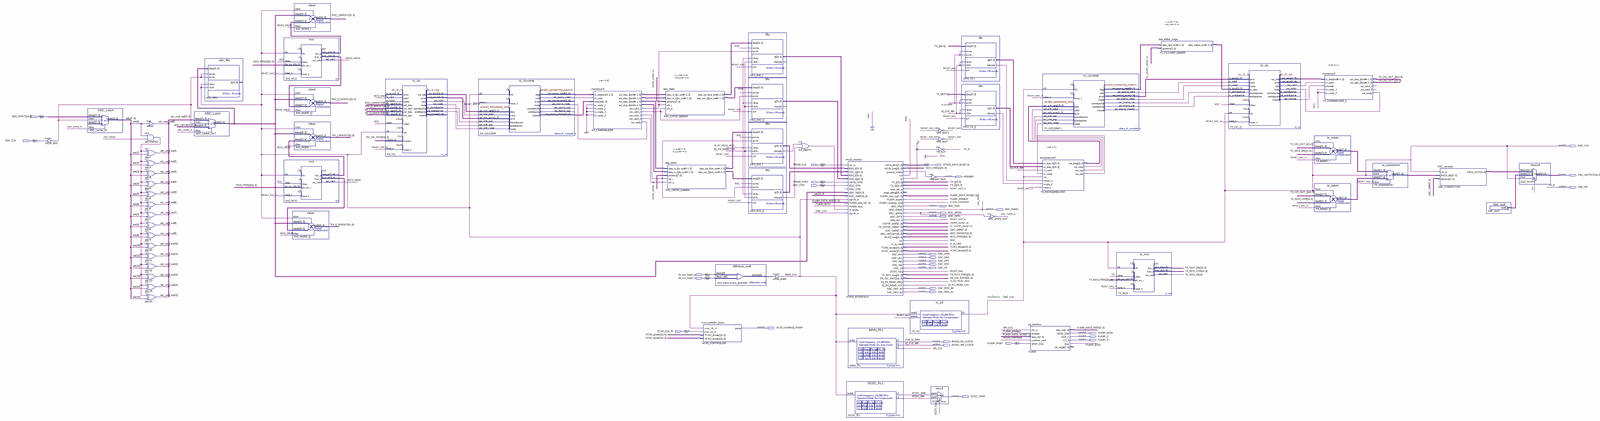
[diagram p0: schematic sheet, whole]
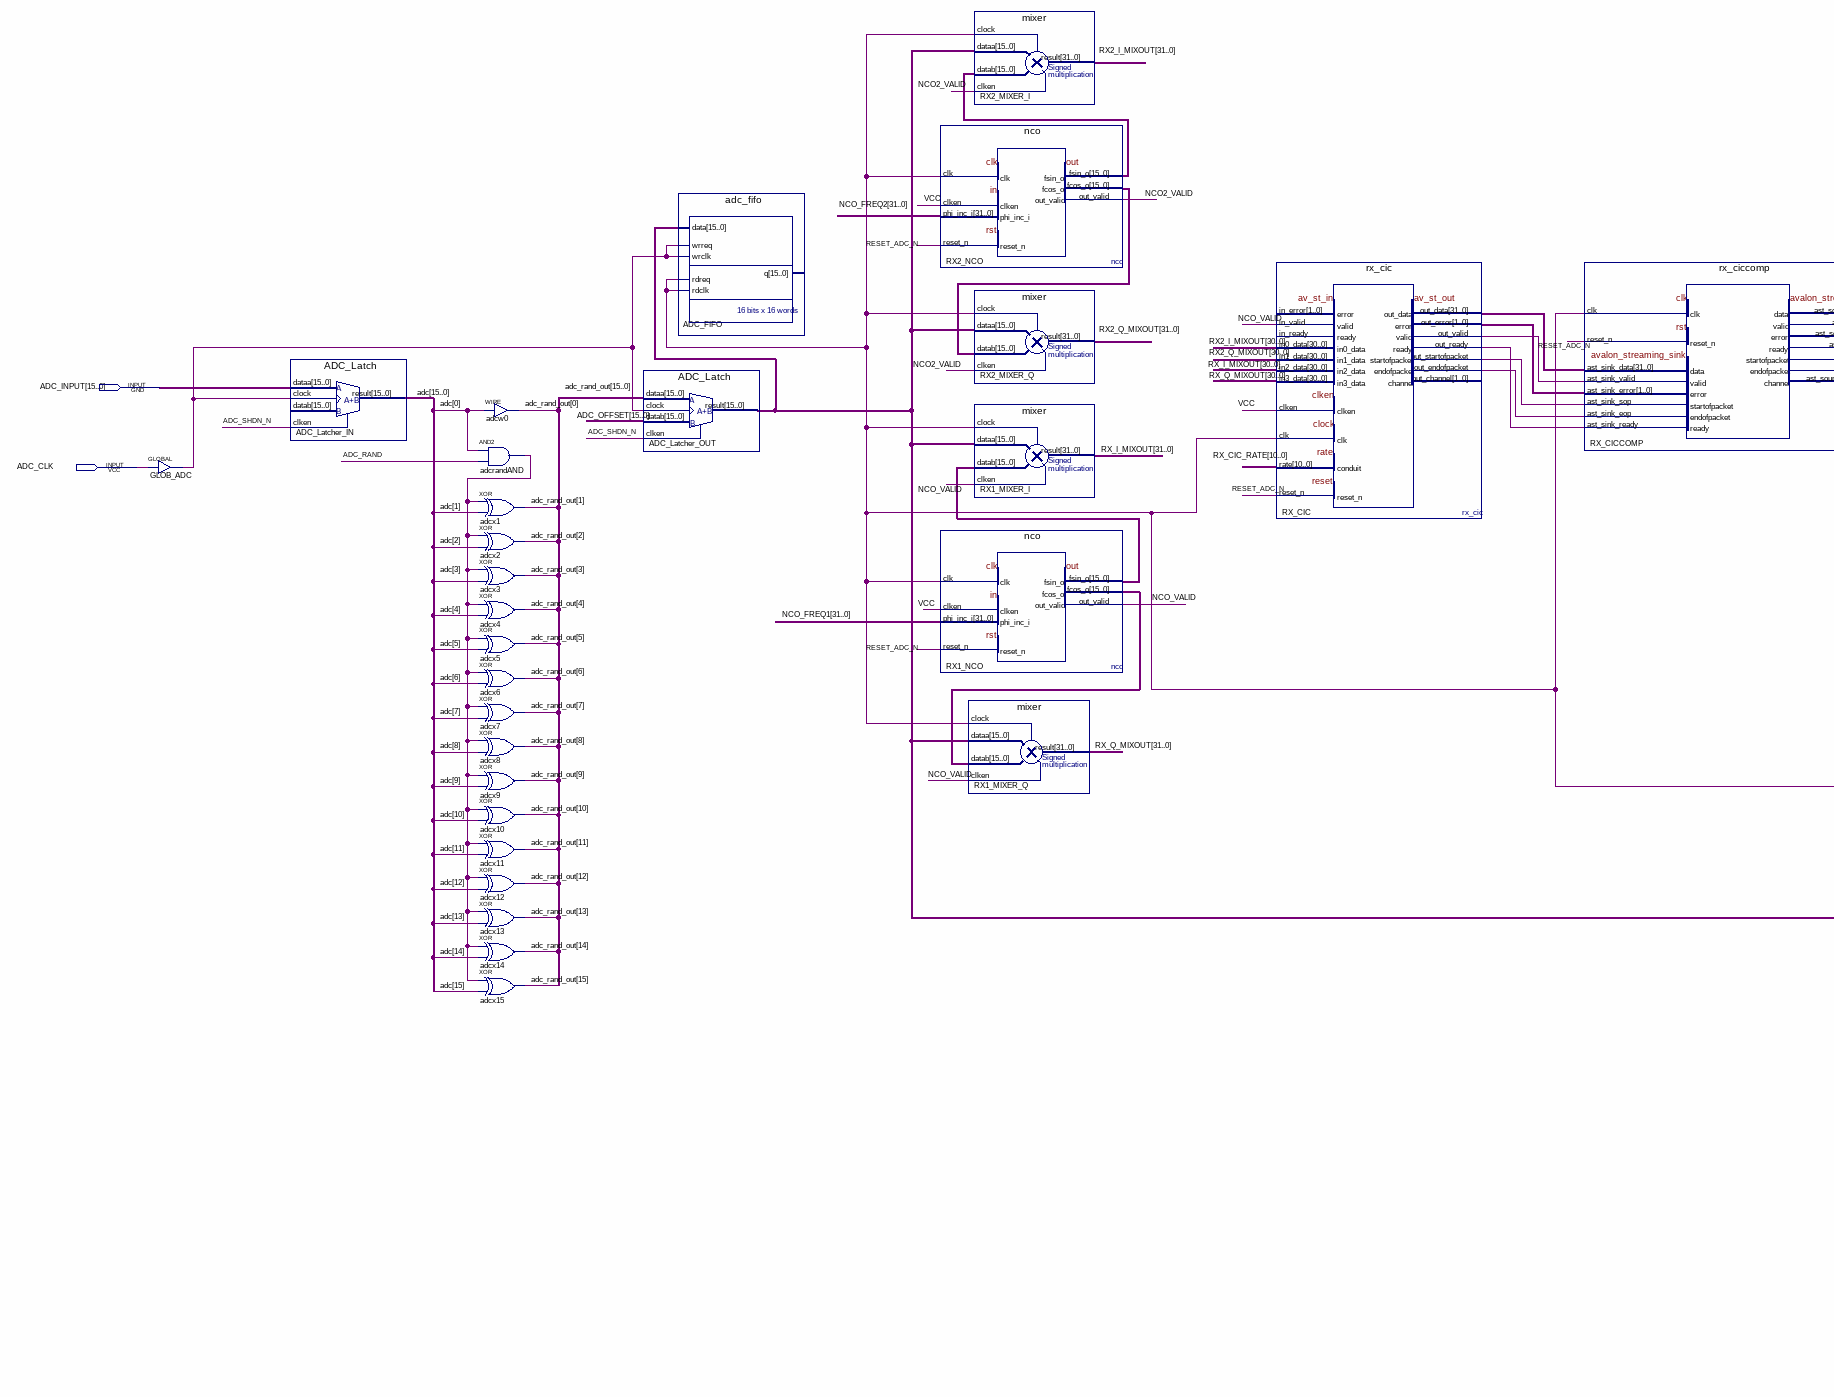
[diagram p1: schematic sheet, left part]
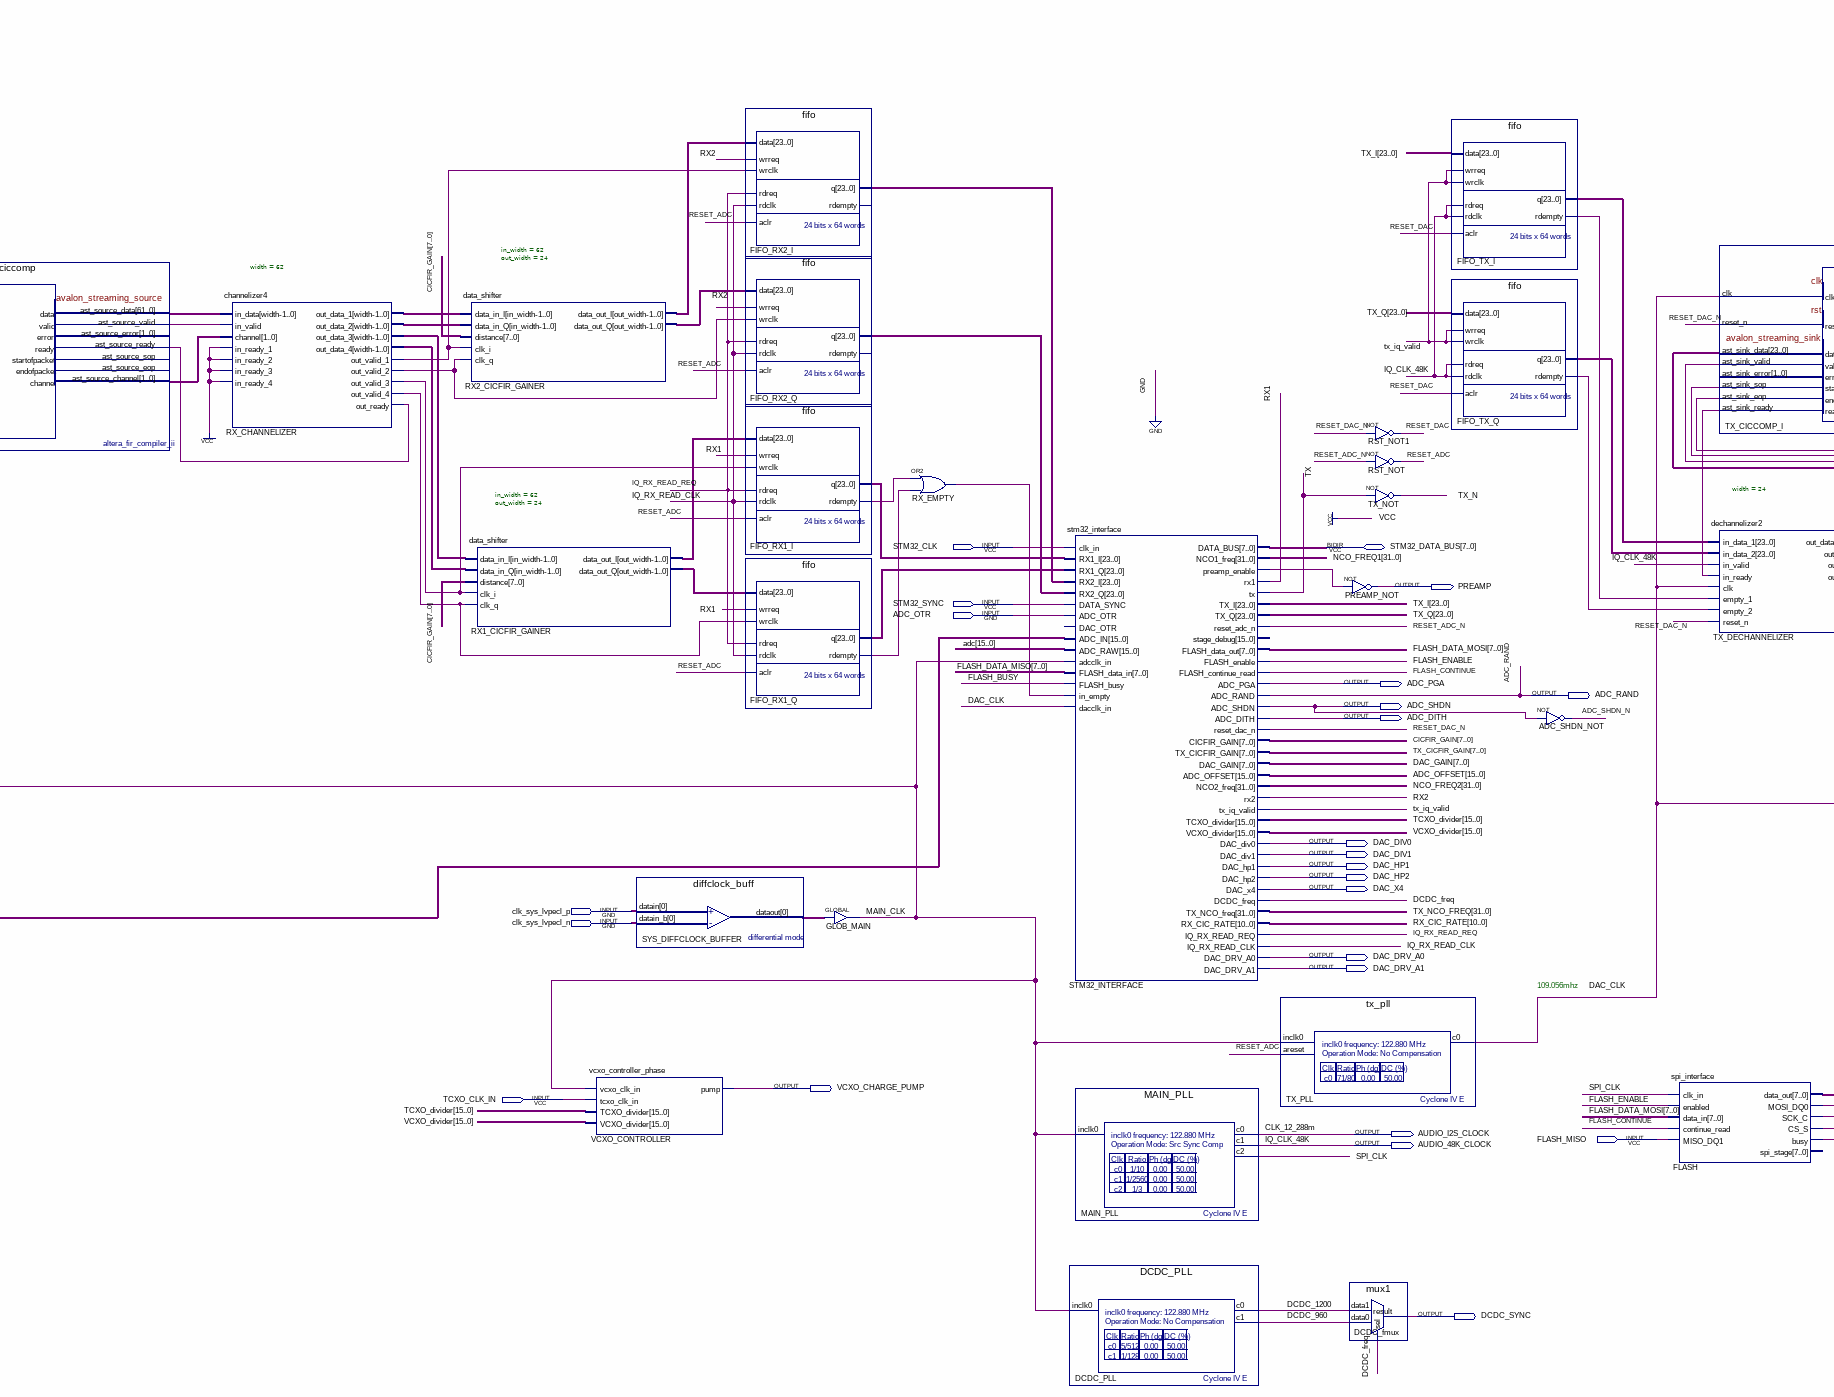
[diagram p2: schematic sheet, centre part]
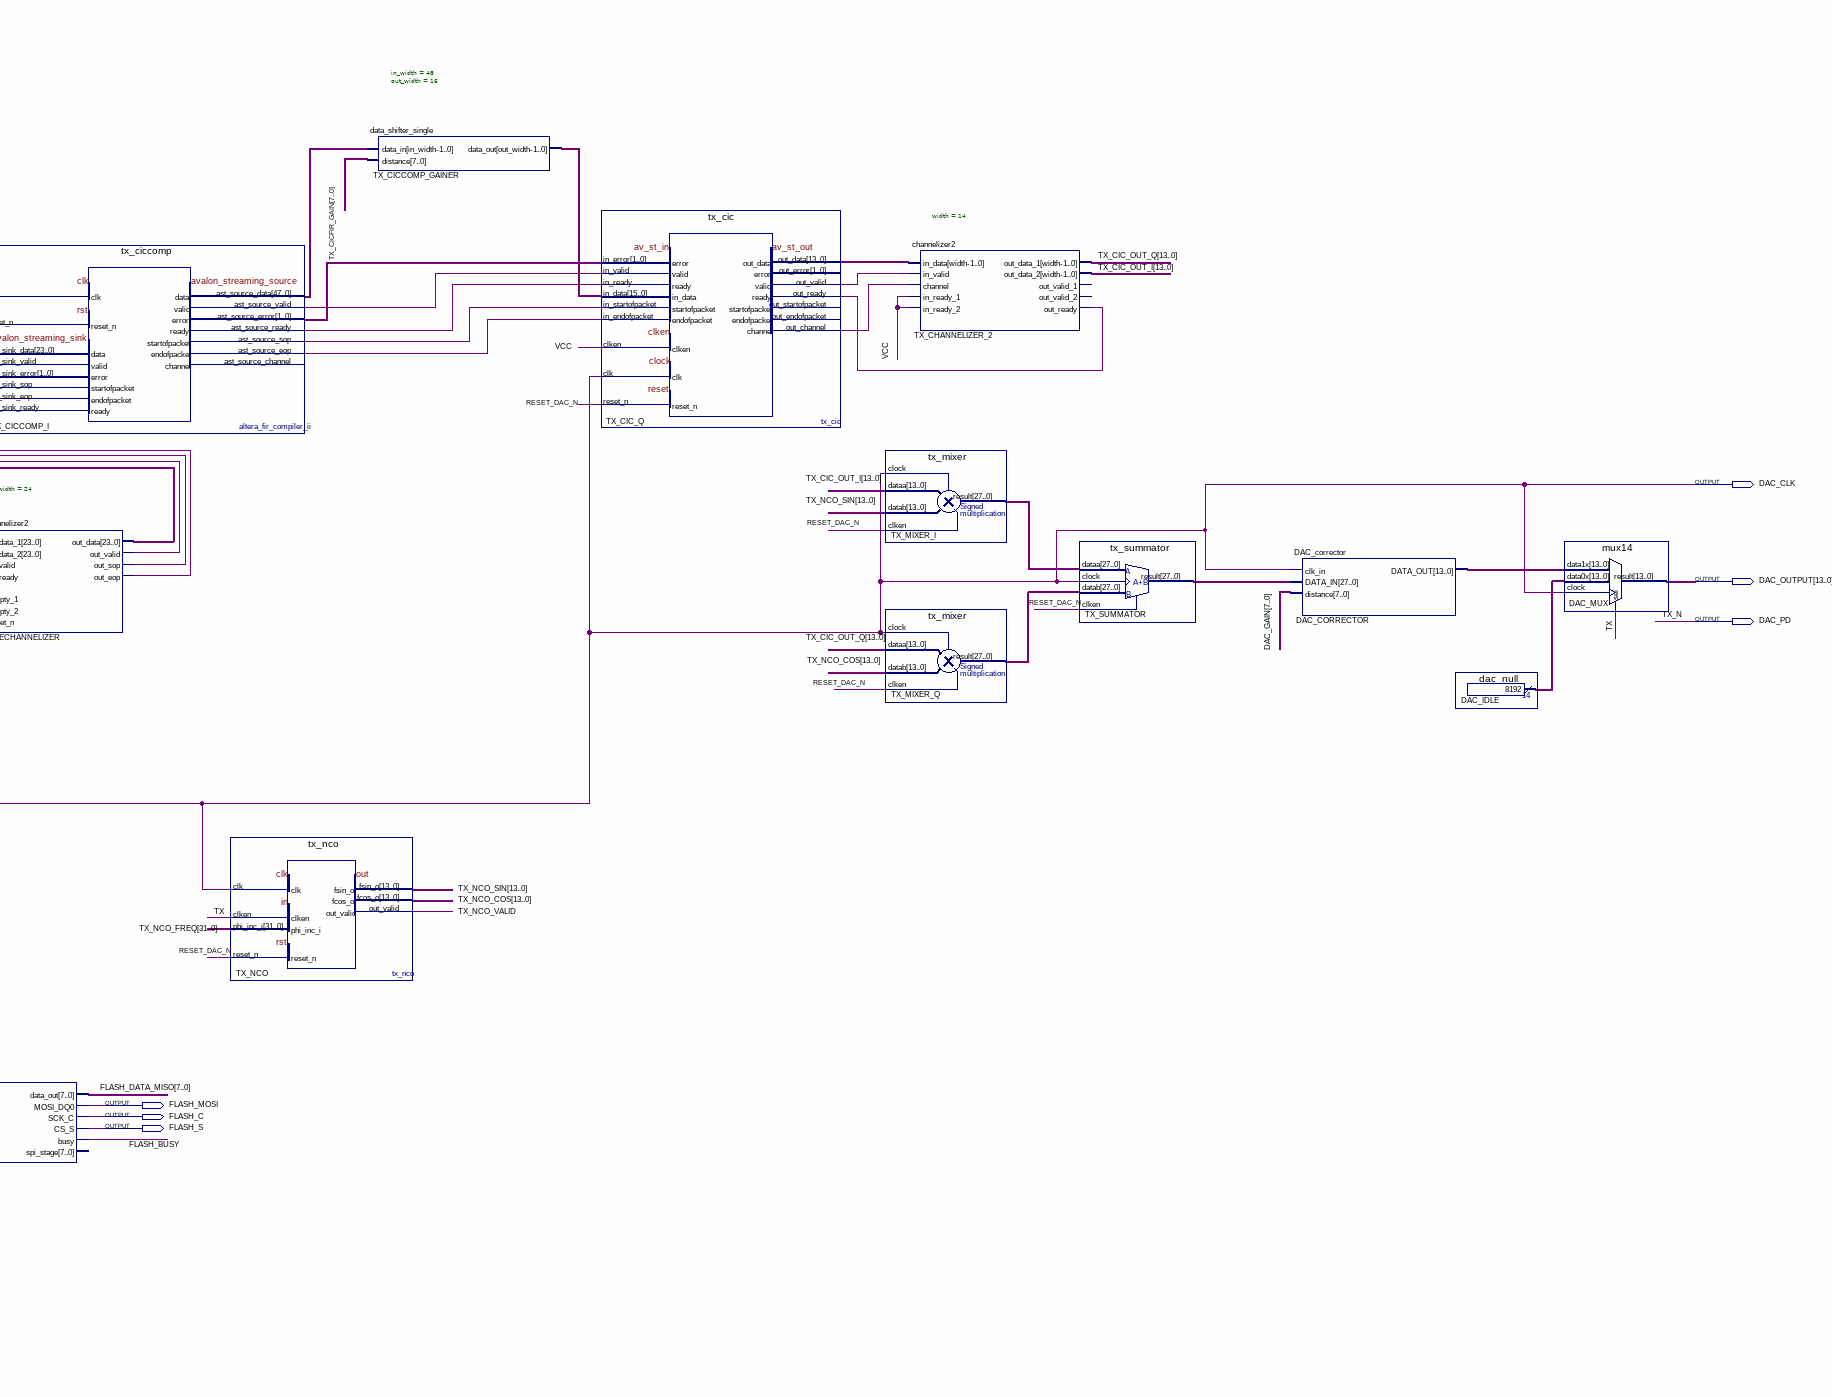
[diagram p3: schematic sheet, right part]
// Quartus schematic WOLF.bdf as structural Verilog: 65 symbols, 32 pins
module WOLF (
  input  [15:0] ADC_INPUT,
  input  ADC_CLK,
  input  STM32_CLK,
  input  STM32_SYNC,
  input  ADC_OTR,
  input  clk_sys_lvpecl_p,
  input  clk_sys_lvpecl_n,
  input  TCXO_CLK_IN,
  input  FLASH_MISO,
  inout  [7:0] STM32_DATA_BUS,
  output DAC_CLK,
  output [13:0] DAC_OUTPUT,
  output PREAMP,
  output DAC_PD,
  output ADC_PGA,
  output ADC_RAND,
  output ADC_SHDN,
  output ADC_DITH,
  output DAC_DIV0,
  output DAC_DIV1,
  output DAC_HP1,
  output DAC_HP2,
  output DAC_X4,
  output DAC_DRV_A0,
  output DAC_DRV_A1,
  output VCXO_CHARGE_PUMP,
  output FLASH_MOSI,
  output FLASH_C,
  output FLASH_S,
  output AUDIO_I2S_CLOCK,
  output AUDIO_48K_CLOCK,
  output DCDC_SYNC
);

  wire ADC_SHDN_N, adcrandAND_out, DCDC_960, DCDC_1200, DCDC_freq, FIFO_RX1_I_rdempty, FIFO_RX1_Q_rdempty,
       FIFO_TX_I_rdempty, FIFO_TX_Q_rdempty, FLASH_BUSY, FLASH_CONTINUE, FLASH_ENABLE, GLOB_ADC_out,
       IQ_RX_READ_CLK, IQ_RX_READ_REQ, MAIN_CLK, NCO2_VALID, NCO_VALID, RESET_ADC, RESET_ADC_N, RESET_DAC,
       RESET_DAC_N, RX1, RX2, RX_CHANNELIZER_out_ready, RX_CHANNELIZER_out_valid_1,
       RX_CHANNELIZER_out_valid_2, RX_CHANNELIZER_out_valid_3, RX_CHANNELIZER_out_valid_4,
       RX_CIC_out_endofpacket, RX_CIC_out_startofpacket, RX_CIC_out_valid, RX_CICCOMP_ast_sink_ready,
       RX_CICCOMP_ast_source_valid, RX_EMPTY_out, SPI_CLK, STM32_INTERFACE_preamp_enable,
       SYS_DIFFCLOCK_BUFFER_dataout, TX, TX_CHANNELIZER_2_out_ready, TX_CIC_Q_in_ready, TX_CIC_Q_out_channel,
       TX_CIC_Q_out_valid, TX_CICCOMP_I_ast_sink_ready, TX_CICCOMP_I_ast_source_eop,
       TX_CICCOMP_I_ast_source_sop, TX_CICCOMP_I_ast_source_valid, TX_DECHANNELIZER_out_eop,
       TX_DECHANNELIZER_out_sop, TX_DECHANNELIZER_out_valid, tx_iq_valid, TX_NCO_VALID;
  wire [1:0] RX_CIC_out_error, RX_CICCOMP_ast_source_channel, TX_CICCOMP_I_ast_source_error;
  wire [7:0] CICFIR_GAIN, DAC_GAIN, FLASH_DATA_MISO, FLASH_DATA_MOSI, TX_CICFIR_GAIN;
  wire [10:0] RX_CIC_RATE;
  wire [13:0] DAC_CORRECTOR_data_out, DAC_IDLE_result, TX_CIC_OUT_I, TX_CIC_OUT_Q, TX_CIC_Q_out_data,
       TX_NCO_COS, TX_NCO_SIN;
  wire [15:0] adc, ADC_Latcher_OUT_result, ADC_OFFSET, adc_rand_out, RX1_NCO_fcos_o, RX1_NCO_fsin_o,
       RX2_NCO_fcos_o, RX2_NCO_fsin_o, TCXO_divider, TX_CICCOMP_GAINER_data_out, VCXO_divider;
  wire [23:0] FIFO_RX1_I_q, FIFO_RX1_Q_q, FIFO_RX2_I_q, FIFO_RX2_Q_q, FIFO_TX_I_q, FIFO_TX_Q_q,
       RX1_CICFIR_GAINER_data_out_i, RX1_CICFIR_GAINER_data_out_q, RX2_CICFIR_GAINER_data_out_i,
       RX2_CICFIR_GAINER_data_out_q, TX_DECHANNELIZER_out_data, TX_I, TX_Q;
  wire [27:0] TX_MIXER_I_result, TX_MIXER_Q_result, TX_SUMMATOR_result;
  wire [31:0] NCO_FREQ1, NCO_FREQ2, RX2_I_MIXOUT, RX2_Q_MIXOUT, RX_CIC_out_data, RX_I_MIXOUT, RX_Q_MIXOUT,
       TX_NCO_FREQ;
  wire [47:0] TX_CICCOMP_I_ast_source_data;
  wire [61:0] RX_CHANNELIZER_out_data_1, RX_CHANNELIZER_out_data_2, RX_CHANNELIZER_out_data_3,
       RX_CHANNELIZER_out_data_4, RX_CICCOMP_ast_source_data;

  GLOBAL GLOB_ADC (.IN(ADC_CLK), .OUT(GLOB_ADC_out));
  ADC_Latch ADC_Latcher_IN (.dataa(ADC_INPUT), .clken(ADC_SHDN_N), .clock(GLOB_ADC_out), .result(adc));  // open: datab
  assign adc_rand_out[0] = adc[0];  // WIRE adcw0
  and adcrandAND (adcrandAND_out, adc[0], ADC_RAND);
  xor adcx1 (adc_rand_out[1], adcrandAND_out, adc[1]);
  xor adcx2 (adc_rand_out[2], adcrandAND_out, adc[2]);
  xor adcx3 (adc_rand_out[3], adcrandAND_out, adc[3]);
  xor adcx4 (adc_rand_out[4], adcrandAND_out, adc[4]);
  xor adcx5 (adc_rand_out[5], adcrandAND_out, adc[5]);
  xor adcx6 (adc_rand_out[6], adcrandAND_out, adc[6]);
  xor adcx7 (adc_rand_out[7], adcrandAND_out, adc[7]);
  xor adcx8 (adc_rand_out[8], adcrandAND_out, adc[8]);
  xor adcx9 (adc_rand_out[9], adcrandAND_out, adc[9]);
  xor adcx10 (adc_rand_out[10], adcrandAND_out, adc[10]);
  xor adcx11 (adc_rand_out[11], adcrandAND_out, adc[11]);
  xor adcx12 (adc_rand_out[12], adcrandAND_out, adc[12]);
  xor adcx13 (adc_rand_out[13], adcrandAND_out, adc[13]);
  xor adcx14 (adc_rand_out[14], adcrandAND_out, adc[14]);
  xor adcx15 (adc_rand_out[15], adcrandAND_out, adc[15]);
  adc_fifo ADC_FIFO (
    .data(ADC_Latcher_OUT_result), .wrreq(GLOB_ADC_out), .wrclk(GLOB_ADC_out), .rdreq(MAIN_CLK),
    .rdclk(MAIN_CLK));  // open: q
  ADC_Latch ADC_Latcher_OUT (
    .dataa(adc_rand_out), .datab(ADC_OFFSET), .clken(ADC_SHDN_N), .clock(GLOB_ADC_out),
    .result(ADC_Latcher_OUT_result));
  nco RX2_NCO (
    .clk(MAIN_CLK), .clken(1'b1), .phi_inc_i(NCO_FREQ2), .reset_n(RESET_ADC_N), .fsin_o(RX2_NCO_fsin_o),
    .fcos_o(RX2_NCO_fcos_o), .out_valid(NCO2_VALID));
  nco RX1_NCO (
    .clk(MAIN_CLK), .clken(1'b1), .phi_inc_i(NCO_FREQ1), .reset_n(RESET_ADC_N), .fsin_o(RX1_NCO_fsin_o),
    .fcos_o(RX1_NCO_fcos_o), .out_valid(NCO_VALID));
  mixer RX2_MIXER_I (
    .clock(MAIN_CLK), .dataa(ADC_Latcher_OUT_result), .datab(RX2_NCO_fsin_o), .clken(NCO2_VALID),
    .result(RX2_I_MIXOUT));
  mixer RX2_MIXER_Q (
    .clock(MAIN_CLK), .dataa(ADC_Latcher_OUT_result), .datab(RX2_NCO_fcos_o), .clken(NCO2_VALID),
    .result(RX2_Q_MIXOUT));
  mixer RX1_MIXER_I (
    .clock(MAIN_CLK), .dataa(ADC_Latcher_OUT_result), .datab(RX1_NCO_fsin_o), .clken(NCO_VALID),
    .result(RX_I_MIXOUT));
  mixer RX1_MIXER_Q (
    .clock(MAIN_CLK), .dataa(ADC_Latcher_OUT_result), .datab(RX1_NCO_fcos_o), .clken(NCO_VALID),
    .result(RX_Q_MIXOUT));
  rx_cic RX_CIC (
    .in_valid(NCO_VALID), .in0_data(RX2_I_MIXOUT[30:0]), .in1_data(RX2_Q_MIXOUT[30:0]),
    .in2_data(RX_I_MIXOUT[30:0]), .in3_data(RX_Q_MIXOUT[30:0]), .out_ready(RX_CICCOMP_ast_sink_ready),
    .clken(1'b1), .clk(MAIN_CLK), .rate(RX_CIC_RATE), .reset_n(RESET_ADC_N), .out_data(RX_CIC_out_data),
    .out_error(RX_CIC_out_error), .out_valid(RX_CIC_out_valid), .out_startofpacket(RX_CIC_out_startofpacket),
    .out_endofpacket(RX_CIC_out_endofpacket));  // open: in_error, in_ready, out_channel
  rx_ciccomp RX_CICCOMP (
    .clk(MAIN_CLK), .reset_n(RESET_ADC_N), .ast_sink_data(RX_CIC_out_data),
    .ast_sink_valid(RX_CIC_out_valid), .ast_sink_error(RX_CIC_out_error),
    .ast_sink_sop(RX_CIC_out_startofpacket), .ast_sink_eop(RX_CIC_out_endofpacket),
    .ast_source_ready(RX_CHANNELIZER_out_ready), .ast_sink_ready(RX_CICCOMP_ast_sink_ready),
    .ast_source_data(RX_CICCOMP_ast_source_data), .ast_source_valid(RX_CICCOMP_ast_source_valid),
    .ast_source_channel(RX_CICCOMP_ast_source_channel));  // open: ast_source_error, ast_source_sop, ast_source_eop
  channelizer4 #(.width(62)) RX_CHANNELIZER (
    .in_data(RX_CICCOMP_ast_source_data), .in_valid(RX_CICCOMP_ast_source_valid),
    .channel(RX_CICCOMP_ast_source_channel), .in_ready_1(1'b1), .in_ready_2(1'b1), .in_ready_3(1'b1),
    .in_ready_4(1'b1), .out_data_1(RX_CHANNELIZER_out_data_1), .out_data_2(RX_CHANNELIZER_out_data_2),
    .out_data_3(RX_CHANNELIZER_out_data_3), .out_data_4(RX_CHANNELIZER_out_data_4),
    .out_valid_1(RX_CHANNELIZER_out_valid_1), .out_valid_2(RX_CHANNELIZER_out_valid_2),
    .out_valid_3(RX_CHANNELIZER_out_valid_3), .out_valid_4(RX_CHANNELIZER_out_valid_4),
    .out_ready(RX_CHANNELIZER_out_ready));
  data_shifter #(.in_width(62), .out_width(24)) RX2_CICFIR_GAINER (
    .data_in_I(RX_CHANNELIZER_out_data_1), .data_in_Q(RX_CHANNELIZER_out_data_2), .distance(CICFIR_GAIN),
    .clk_i(RX_CHANNELIZER_out_valid_1), .clk_q(RX_CHANNELIZER_out_valid_2),
    .data_out_I(RX2_CICFIR_GAINER_data_out_i), .data_out_Q(RX2_CICFIR_GAINER_data_out_q));
  data_shifter #(.in_width(62), .out_width(24)) RX1_CICFIR_GAINER (
    .data_in_I(RX_CHANNELIZER_out_data_3), .data_in_Q(RX_CHANNELIZER_out_data_4), .distance(CICFIR_GAIN),
    .clk_i(RX_CHANNELIZER_out_valid_3), .clk_q(RX_CHANNELIZER_out_valid_4),
    .data_out_I(RX1_CICFIR_GAINER_data_out_i), .data_out_Q(RX1_CICFIR_GAINER_data_out_q));
  vcxo_controller_phase VCXO_CONTROLLER (
    .vcxo_clk_in(MAIN_CLK), .tcxo_clk_in(TCXO_CLK_IN), .TCXO_divider(TCXO_divider),
    .VCXO_divider(VCXO_divider), .pump(VCXO_CHARGE_PUMP));
  diffclock_buff SYS_DIFFCLOCK_BUFFER (
    .datain(clk_sys_lvpecl_p), .datain_b(clk_sys_lvpecl_n), .dataout(SYS_DIFFCLOCK_BUFFER_dataout));
  fifo FIFO_RX2_I (
    .data(RX2_CICFIR_GAINER_data_out_i), .wrreq(RX2), .wrclk(RX_CHANNELIZER_out_valid_1),
    .rdreq(IQ_RX_READ_REQ), .rdclk(IQ_RX_READ_CLK), .aclr(RESET_ADC), .q(FIFO_RX2_I_q));  // open: rdempty
  fifo FIFO_RX2_Q (
    .data(RX2_CICFIR_GAINER_data_out_q), .wrreq(RX2), .wrclk(RX_CHANNELIZER_out_valid_2),
    .rdreq(IQ_RX_READ_REQ), .rdclk(IQ_RX_READ_CLK), .aclr(RESET_ADC), .q(FIFO_RX2_Q_q));  // open: rdempty
  fifo FIFO_RX1_I (
    .data(RX1_CICFIR_GAINER_data_out_i), .wrreq(RX1), .wrclk(RX_CHANNELIZER_out_valid_3),
    .rdreq(IQ_RX_READ_REQ), .rdclk(IQ_RX_READ_CLK), .aclr(RESET_ADC), .q(FIFO_RX1_I_q),
    .rdempty(FIFO_RX1_I_rdempty));
  fifo FIFO_RX1_Q (
    .data(RX1_CICFIR_GAINER_data_out_q), .wrreq(RX1), .wrclk(RX_CHANNELIZER_out_valid_4),
    .rdreq(IQ_RX_READ_REQ), .rdclk(IQ_RX_READ_CLK), .aclr(RESET_ADC), .q(FIFO_RX1_Q_q),
    .rdempty(FIFO_RX1_Q_rdempty));
  GLOBAL GLOB_MAIN (.IN(SYS_DIFFCLOCK_BUFFER_dataout), .OUT(MAIN_CLK));
  or RX_EMPTY (RX_EMPTY_out, FIFO_RX1_I_rdempty, FIFO_RX1_Q_rdempty);
  stm32_interface STM32_INTERFACE (
    .clk_in(STM32_CLK), .RX1_I(FIFO_RX1_I_q), .RX1_Q(FIFO_RX1_Q_q), .RX2_I(FIFO_RX2_I_q),
    .RX2_Q(FIFO_RX2_Q_q), .DATA_SYNC(STM32_SYNC), .ADC_OTR(ADC_OTR), .ADC_IN(ADC_Latcher_OUT_result),
    .ADC_RAW(adc), .adcclk_in(MAIN_CLK), .FLASH_data_in(FLASH_DATA_MISO), .FLASH_busy(FLASH_BUSY),
    .in_empty(RX_EMPTY_out), .dacclk_in(DAC_CLK), .NCO1_freq(NCO_FREQ1),
    .preamp_enable(STM32_INTERFACE_preamp_enable), .rx1(RX1), .tx(TX), .TX_I(TX_I), .TX_Q(TX_Q),
    .reset_adc_n(RESET_ADC_N), .FLASH_data_out(FLASH_DATA_MOSI), .FLASH_enable(FLASH_ENABLE),
    .FLASH_continue_read(FLASH_CONTINUE), .ADC_PGA(ADC_PGA), .ADC_RAND(ADC_RAND), .ADC_SHDN(ADC_SHDN),
    .ADC_DITH(ADC_DITH), .reset_dac_n(RESET_DAC_N), .CICFIR_GAIN(CICFIR_GAIN),
    .TX_CICFIR_GAIN(TX_CICFIR_GAIN), .DAC_GAIN(DAC_GAIN), .ADC_OFFSET(ADC_OFFSET), .NCO2_freq(NCO_FREQ2),
    .rx2(RX2), .tx_iq_valid(tx_iq_valid), .TCXO_divider(TCXO_divider), .VCXO_divider(VCXO_divider),
    .DAC_div0(DAC_DIV0), .DAC_div1(DAC_DIV1), .DAC_hp1(DAC_HP1), .DAC_hp2(DAC_HP2), .DAC_x4(DAC_X4),
    .DCDC_freq(DCDC_freq), .TX_NCO_freq(TX_NCO_FREQ), .RX_CIC_RATE(RX_CIC_RATE),
    .IQ_RX_READ_REQ(IQ_RX_READ_REQ), .IQ_RX_READ_CLK(IQ_RX_READ_CLK), .DAC_DRV_A0(DAC_DRV_A0),
    .DAC_DRV_A1(DAC_DRV_A1), .DATA_BUS(STM32_DATA_BUS));  // open: DAC_OTR, stage_debug
  MAIN_PLL MAIN_PLL (.inclk0(MAIN_CLK), .c0(AUDIO_I2S_CLOCK), .c1(AUDIO_48K_CLOCK), .c2(SPI_CLK));
  DCDC_PLL DCDC_PLL (.inclk0(MAIN_CLK), .c0(DCDC_1200), .c1(DCDC_960));
  tx_pll TX_PLL (.inclk0(MAIN_CLK), .areset(RESET_ADC), .c0(DAC_CLK));
  not RST_NOT1 (RESET_DAC, RESET_DAC_N);
  not RST_NOT (RESET_ADC, RESET_ADC_N);
  not TX_NOT (DAC_PD, TX);
  not PREAMP_NOT (PREAMP, STM32_INTERFACE_preamp_enable);
  mux1 DCDC_fmux (.data1(DCDC_1200), .data0(DCDC_960), .sel(DCDC_freq), .result(DCDC_SYNC));
  fifo FIFO_TX_I (
    .data(TX_I), .wrreq(tx_iq_valid), .wrclk(tx_iq_valid), .rdreq(AUDIO_48K_CLOCK), .rdclk(AUDIO_48K_CLOCK),
    .aclr(RESET_DAC), .q(FIFO_TX_I_q), .rdempty(FIFO_TX_I_rdempty));
  fifo FIFO_TX_Q (
    .data(TX_Q), .wrreq(tx_iq_valid), .wrclk(tx_iq_valid), .rdreq(AUDIO_48K_CLOCK), .rdclk(AUDIO_48K_CLOCK),
    .aclr(RESET_DAC), .q(FIFO_TX_Q_q), .rdempty(FIFO_TX_Q_rdempty));
  not ADC_SHDN_NOT (ADC_SHDN_N, ADC_SHDN);
  spi_interface FLASH (
    .clk_in(SPI_CLK), .enabled(FLASH_ENABLE), .data_in(FLASH_DATA_MOSI), .continue_read(FLASH_CONTINUE),
    .MISO_DQ1(FLASH_MISO), .data_out(FLASH_DATA_MISO), .MOSI_DQ0(FLASH_MOSI), .SCK_C(FLASH_C),
    .CS_S(FLASH_S), .busy(FLASH_BUSY));  // open: spi_stage
  tx_ciccomp TX_CICCOMP_I (
    .clk(DAC_CLK), .reset_n(RESET_DAC_N), .ast_sink_data(TX_DECHANNELIZER_out_data),
    .ast_sink_valid(TX_DECHANNELIZER_out_valid), .ast_sink_sop(TX_DECHANNELIZER_out_sop),
    .ast_sink_eop(TX_DECHANNELIZER_out_eop), .ast_source_ready(TX_CIC_Q_in_ready),
    .ast_sink_ready(TX_CICCOMP_I_ast_sink_ready), .ast_source_data(TX_CICCOMP_I_ast_source_data),
    .ast_source_valid(TX_CICCOMP_I_ast_source_valid), .ast_source_error(TX_CICCOMP_I_ast_source_error),
    .ast_source_sop(TX_CICCOMP_I_ast_source_sop), .ast_source_eop(TX_CICCOMP_I_ast_source_eop));  // open: ast_sink_error, ast_source_channel
  dechannelizer2 #(.width(24)) TX_DECHANNELIZER (
    .in_data_1(FIFO_TX_I_q), .in_data_2(FIFO_TX_Q_q), .in_valid(AUDIO_48K_CLOCK),
    .in_ready(TX_CICCOMP_I_ast_sink_ready), .clk(DAC_CLK), .empty_1(FIFO_TX_I_rdempty),
    .empty_2(FIFO_TX_Q_rdempty), .reset_n(RESET_DAC_N), .out_data(TX_DECHANNELIZER_out_data),
    .out_valid(TX_DECHANNELIZER_out_valid), .out_sop(TX_DECHANNELIZER_out_sop),
    .out_eop(TX_DECHANNELIZER_out_eop));
  tx_nco TX_NCO (
    .clk(DAC_CLK), .clken(TX), .phi_inc_i(TX_NCO_FREQ), .reset_n(RESET_DAC_N), .fsin_o(TX_NCO_SIN),
    .fcos_o(TX_NCO_COS), .out_valid(TX_NCO_VALID));
  data_shifter_single #(.in_width(48), .out_width(16)) TX_CICCOMP_GAINER (
    .data_in(TX_CICCOMP_I_ast_source_data), .distance(TX_CICFIR_GAIN), .data_out(TX_CICCOMP_GAINER_data_out));
  tx_cic TX_CIC_Q (
    .in_error(TX_CICCOMP_I_ast_source_error), .in_valid(TX_CICCOMP_I_ast_source_valid),
    .in_data(TX_CICCOMP_GAINER_data_out), .in_startofpacket(TX_CICCOMP_I_ast_source_sop),
    .in_endofpacket(TX_CICCOMP_I_ast_source_eop), .out_ready(TX_CHANNELIZER_2_out_ready), .clken(1'b1),
    .clk(DAC_CLK), .reset_n(RESET_DAC_N), .in_ready(TX_CIC_Q_in_ready), .out_data(TX_CIC_Q_out_data),
    .out_valid(TX_CIC_Q_out_valid), .out_channel(TX_CIC_Q_out_channel));  // open: out_error, out_startofpacket, out_endofpacket
  channelizer2 #(.width(14)) TX_CHANNELIZER_2 (
    .in_data(TX_CIC_Q_out_data), .in_valid(TX_CIC_Q_out_valid), .channel(TX_CIC_Q_out_channel),
    .in_ready_1(1'b1), .in_ready_2(1'b1), .out_data_1(TX_CIC_OUT_Q), .out_data_2(TX_CIC_OUT_I),
    .out_ready(TX_CHANNELIZER_2_out_ready));  // open: out_valid_1, out_valid_2
  tx_mixer TX_MIXER_I (
    .clock(DAC_CLK), .dataa(TX_CIC_OUT_I), .datab(TX_NCO_SIN), .clken(RESET_DAC_N), .result(TX_MIXER_I_result));
  tx_mixer TX_MIXER_Q (
    .clock(DAC_CLK), .dataa(TX_CIC_OUT_Q), .datab(TX_NCO_COS), .clken(RESET_DAC_N), .result(TX_MIXER_Q_result));
  tx_summator TX_SUMMATOR (
    .dataa(TX_MIXER_I_result), .datab(TX_MIXER_Q_result), .clken(RESET_DAC_N), .clock(DAC_CLK),
    .result(TX_SUMMATOR_result));
  DAC_corrector DAC_CORRECTOR (
    .clk_in(DAC_CLK), .DATA_IN(TX_SUMMATOR_result), .distance(DAC_GAIN), .DATA_OUT(DAC_CORRECTOR_data_out));
  dac_null DAC_IDLE (.result(DAC_IDLE_result));
  mux14 DAC_MUX (
    .data1x(DAC_CORRECTOR_data_out), .data0x(DAC_IDLE_result), .clock(DAC_CLK), .sel(TX), .result(DAC_OUTPUT));

  // Other names for the same wires on the sheet: CLK_12_288m = AUDIO_I2S_CLOCK; IQ_CLK_48K = AUDIO_48K_CLOCK;
  //   TX_N = DAC_PD

  // Notes on the sheet:
  //   109.056mhz
endmodule
